# EAGLE design schematic (EAGLE 9.5.2)
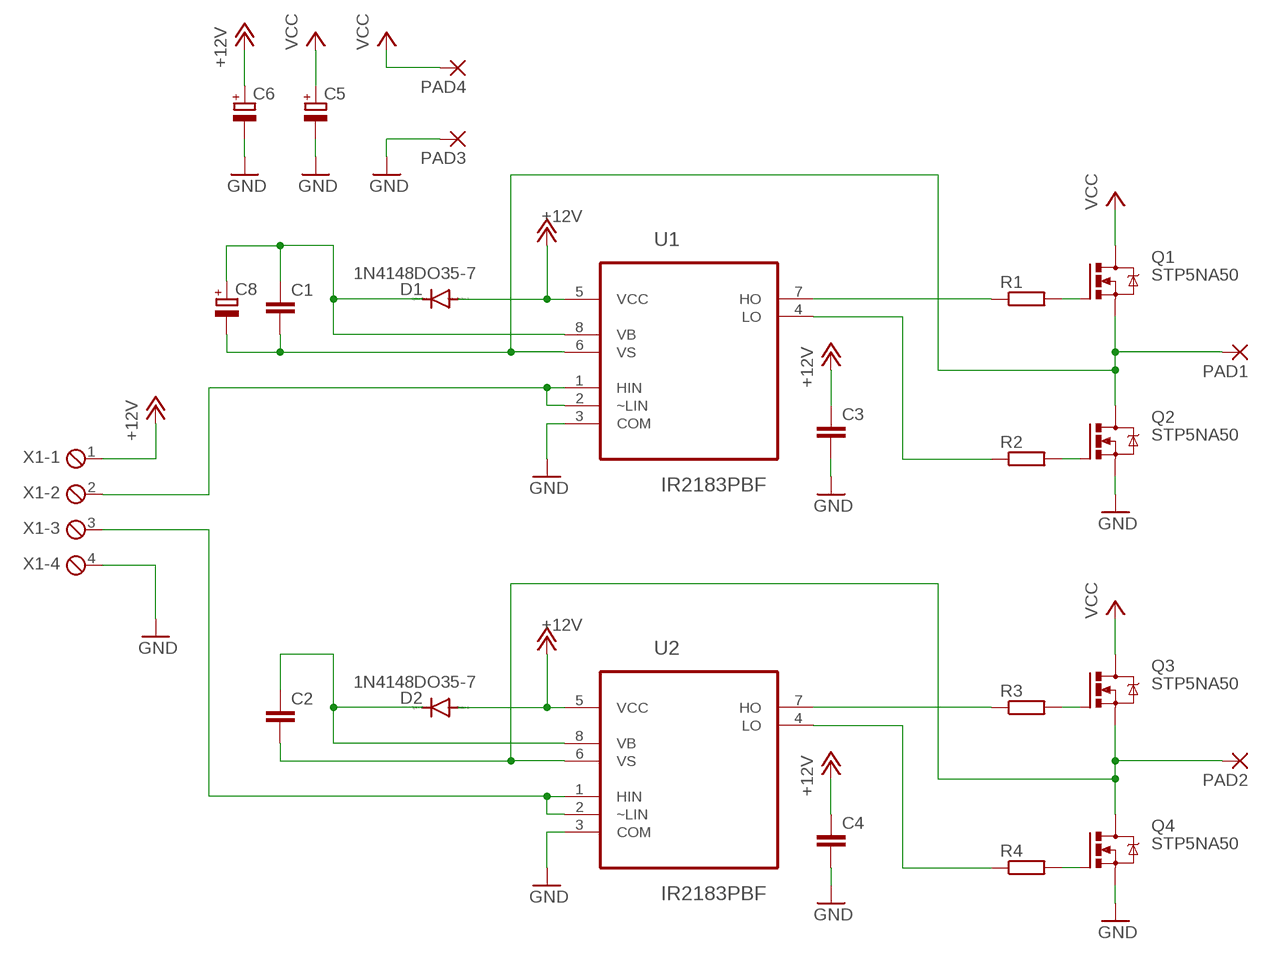
[diagram p0: schematic, sheet 1]

## Parts
C1  C-EU050-024X044  [C050-024X044]
C2  C-EU050-024X044  [C050-024X044]
C3  C-EU050-024X044  [C050-024X044]
C4  C-EU050-024X044  [C050-024X044]
C5  CPOL-EUE5-10.5  [E5-10,5]
C6  CPOL-EUE2.5-6  [E2,5-6]
C8  CPOL-EUE2.5-6  [E2,5-6]
D1  1N4148DO35-7  [DO35-7]
D2  1N4148DO35-7  [DO35-7]
PAD1  3,81/1,4  [3,81/1,4]
PAD2  3,81/1,4  [3,81/1,4]
PAD3  3,81/1,4  [3,81/1,4]
PAD4  3,81/1,4  [3,81/1,4]
Q1  STP5NA50  [TO220BV]
Q2  STP5NA50  [TO220BV]
Q3  STP5NA50  [TO220BV]
Q4  STP5NA50  [TO220BV]
R1  R-EU_0204/7  [0204/7]
R2  R-EU_0204/7  [0204/7]
R3  R-EU_0204/7  [0204/7]
R4  R-EU_0204/7  [0204/7]
U1  IR2183PBF  [DIP254P762X533-8]
U2  IR2183PBF  [DIP254P762X533-8]
X1  MPT4  [4POL254]

## Nets
+12V: C3.1 C4.1 C6.+ D1.A D2.A U1.5(VCC) U2.5(VCC) X1.1
GND: C3.2 C4.2 C5.- C6.- PAD3.1(P) Q2.S Q4.S U1.3(COM) U2.3(COM) X1.4
N$1: Q2.G R2.2
N$2: C1.2 C8.- PAD1.1(P) Q1.S Q2.D U1.6(VS)
N$3: Q1.G R1.2
N$4: R1.1 U1.7(HO)
N$5: R2.1 U1.4(LO)
N$6: C1.1 C8.+ D1.C U1.8(VB)
N$7: U1.1(HIN) U1.2(~LIN) X1.2
N$8: Q4.G R4.2
N$9: C2.2 PAD2.1(P) Q3.S Q4.D U2.6(VS)
N$10: Q3.G R3.2
N$11: R3.1 U2.7(HO)
N$12: R4.1 U2.4(LO)
N$13: C2.1 D2.C U2.8(VB)
N$14: U2.1(HIN) U2.2(~LIN) X1.3
VCC: C5.+ PAD4.1(P) Q1.D Q3.D

## Library data of the parts
C1-C4 = rcl:C-EU: CAPACITOR, European symbol; SPICEPREFIX: C
C5 C6 C8 = rcl:CPOL-EU: POLARIZED CAPACITOR, European symbol; SPICEPREFIX: C
D1 D2 = diode:1N4148: DIODE high speed (Philips)
PAD1-PAD4 = wirepad:3,81/1,4: THROUGH-HOLE PAD
Q1-Q4 = transistor-power:STP5NA50: N-CHANNEL MOS FET
R1-R4 = rcl:R-EU_: RESISTOR, European symbol; SPICEPREFIX: R
U1 U2 = IR2183PBF:IR2183PBF: HALF-BRIDGE DRIVER; AVAILABILITY: Unavailable; DESCRIPTION: Half-Bridge Gate Driver IC Inverting, Non-Inverting 8-PDIP; MF: Infineon Technologies; MP: IR2183PBF; PACKAGE: DIP-8 Infineon; PRICE: None
X1 = con-phoenix-254:MPT4: PHOENIX CONNECTOR; OC_FARNELL: unknown; OC_NEWARK: unknown

## Board
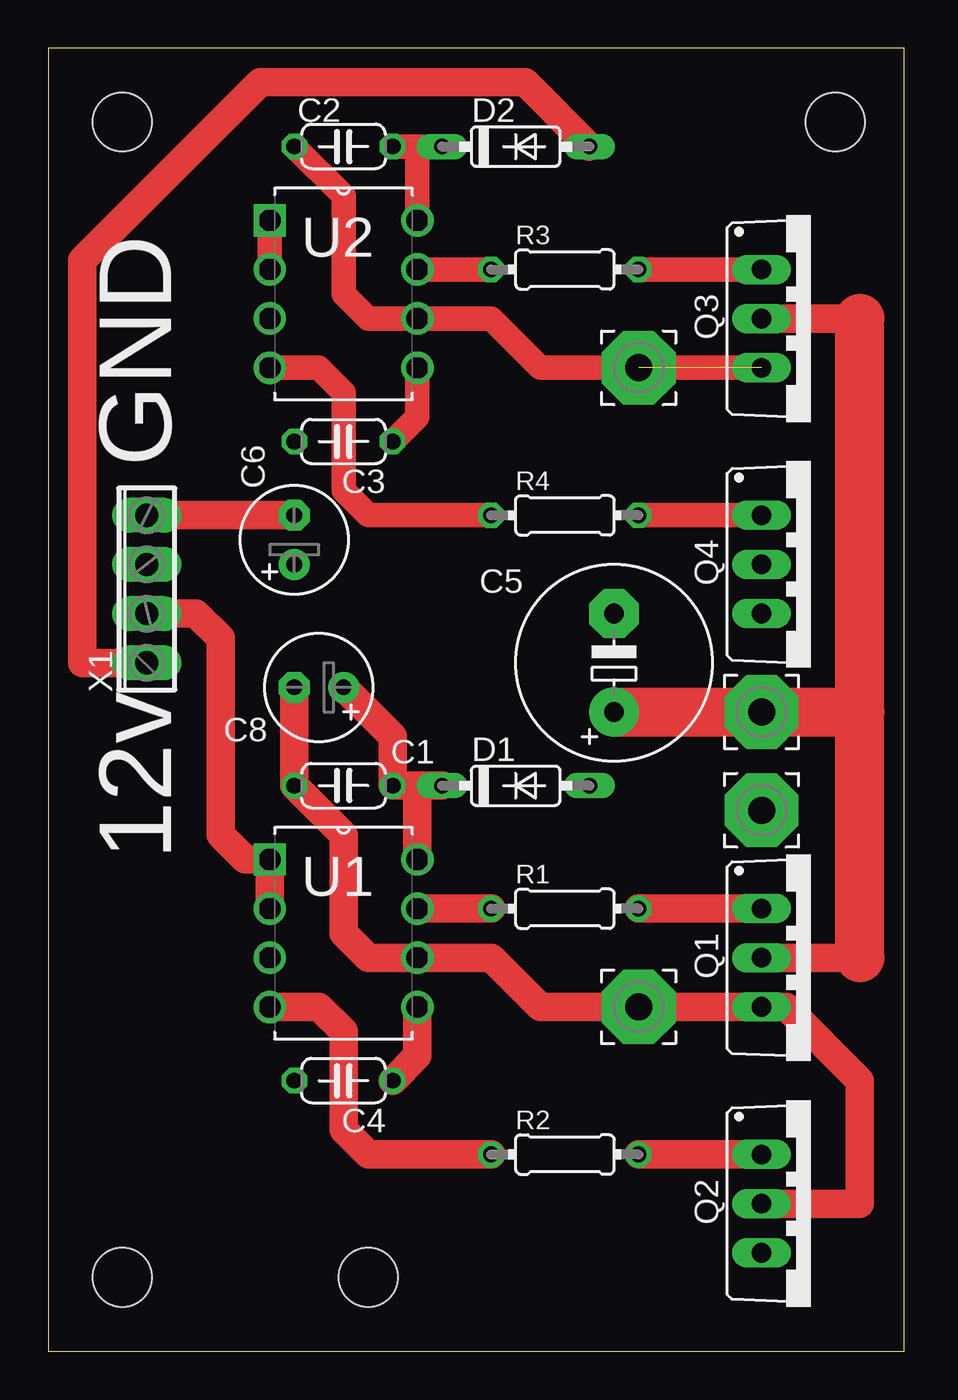
[diagram p1: board, top side]
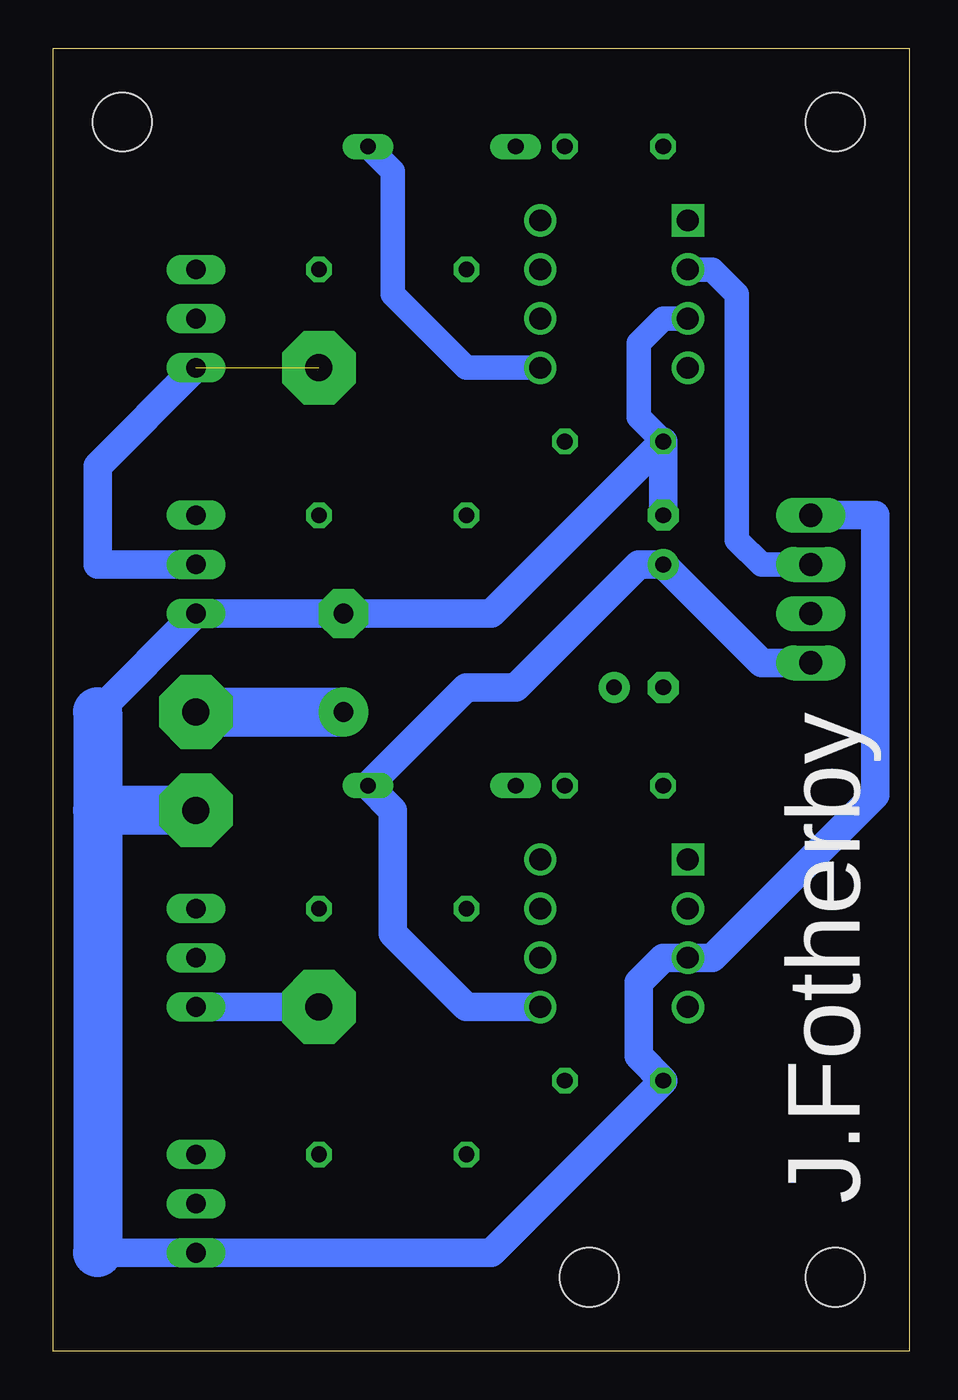
[diagram p2: board, bottom side, seen from below]

Size 44.2 x 67.3 mm. Coordinates in mm from the lower left corner, seen from the top.
Outline: 0,0 44.2,0 44.2,67.3 0,67.3 0,0
Copper layers (1*16): Top 0.035mm / dielectric 1.5mm / Bottom 0.035mm
Design rules "default": minimum track width 6mil, minimum drill 0.35mm, track to track 6mil, track to pad 6mil, pad to pad 6mil, via to via 6mil, smd to smd 6mil, copper to edge 40mil, drill to drill 6mil, minimum pad ring 10mil, minimum via ring 8mil, stop-mask expansion 4mil, vias tented up to drill 0mil, thermal gap 10mil
Holes 3.05 mm at 16.51,3.81 40.64,63.5 3.81,63.5 3.81,3.81

### Footprints (pad centres in the part's own frame; a part is rotated, then mirrored left to right if it is on the bottom)
C050-024X044 = drill 0.813 octagon: 1 -2.54,0; 2 2.54,0
E5-10,5 = drill 1.016 pad 2.54: + -2.54,0 | drill 1.016 pad 2.54 octagon: - 2.54,0
E2,5-6 = drill 0.813 pad 1.6: + -1.27,0 | drill 0.813 pad 1.6 octagon: - 1.27,0
DO35-7 = drill 0.813 long: A 3.81,0; C -3.81,0
3,81/1,4 = drill 1.397 pad 3.81 octagon: 1 0,0
TO220BV = drill 1.016 long: D 0,-2.54; G -2.54,-2.54; S 2.54,-2.54
0204/7 = drill 0.813 octagon: 1 -3.81,0; 2 3.81,0
DIP254P762X533-8 = drill 1.118 square: 1 -7.62,7.62 | drill 1.118: 2 -7.62,5.08; 3 -7.62,2.54; 4 -7.62,0; 5 0,0; 6 0,2.54; 7 0,5.08; 8 0,7.62
4POL254 = drill 1.2 long: 1 -3.81,0; 2 -1.27,0; 3 1.27,0; 4 3.81,0

### Placement (x,y rotation side)
C1  15.24,29.21 180 top
C2  15.24,62.23 180 top
C3  15.24,46.99 180 top
C4  15.24,13.97 180 top
C5  29.21,35.56 90 top
C6  12.7,41.91 90 top
C8  13.97,34.29 180 top
D1  24.13,29.21 0 top
D2  24.13,62.23 0 top
PAD1  30.48,17.78 0 top
PAD2  30.48,50.8 0 top
PAD3  36.83,27.94 270 top
PAD4  36.83,33.02 270 top
Q1  39.37,20.32 270 top
Q2  39.37,7.62 270 top
Q3  39.37,53.34 270 top
Q4  39.37,40.64 270 top
R1  26.67,22.86 0 top
R2  26.67,10.16 0 top
R3  26.67,55.88 0 top
R4  26.67,43.18 0 top
U1  19.05,17.78 0 top
U2  19.05,50.8 0 top
X1  5.08,39.37 90 top

### Tracks (layer width: path | path; a pad name or v marks a point on that pad's centre or on a via)
+12V
  Top 1.27: C3.1 19.05,48.26 U2.5
  Top 1.473: U1.5 19.05,15.24 C4.1 | D2.A 24.62,65.55 10.94,65.55 1.75,56.36 1.75,35.56 X1.1
  Bottom 1.27: D2.A 26.67,60.96 26.67,54.61 22.86,50.8 U2.5
  Bottom 1.473: U1.5 22.86,17.78 26.67,21.59 26.67,27.94 D1.A 22.86,34.29 20.32,34.29 13.97,40.64 C6.+ 7.62,35.56 X1.1
GND
  Top 1.473: X1.4 C6.-
  Bottom 1.27: U2.3 12.7,53.34 13.97,52.07 13.97,48.26 C3.2
  Bottom 1.473: C6.- C3.2 21.59,38.1 C5.- Q4.S 41.91,33.02 | 41.91,5.08 Q2.S 21.59,5.08 C4.2 13.97,15.24 13.97,19.05 12.7,20.32 U1.3 10.16,20.32 1.75,28.73 1.75,43.18 X1.4
  Bottom 2.54: 41.91,33.02 41.91,27.94 | 41.91,27.94 41.91,5.08 | PAD3.1 41.91,27.94
N$1
  Top 1.473: R2.2 Q2.G
N$2
  Top 1.473: Q2.D 41.91,7.62 41.91,13.97 38.1,17.78 Q1.S 25.4,17.78 22.86,20.32 U1.6 16.51,20.32 15.24,21.59 15.24,26.67 C1.2 C8.-
  Bottom 1.473: Q1.S PAD1.1
N$3
  Top 1.473: R1.2 Q1.G
N$4
  Top 1.473: U1.7 R1.1
N$5
  Top 1.473: U1.4 13.97,17.78 15.24,16.51 15.24,11.43 16.51,10.16 R2.1
N$6
  Top 1.473: U1.8 19.05,29.21 | 19.05,29.21 C1.1 17.78,31.75 C8.+ | D1.C 19.05,29.21
N$7
  Top 1.473: U1.2 U1.1 10.16,25.4 8.89,26.67 8.89,36.83 7.62,38.1 X1.2
N$8
  Top 1.27: R4.2 Q4.G
N$9  (1 unrouted)
  Top 1.27: Q3.S 25.4,50.8 22.86,53.34 U2.6 16.51,53.34 15.24,54.61 15.24,59.69 C2.2
  Bottom 1.473: Q4.D 41.91,40.64 41.91,45.72 Q3.S
N$10
  Top 1.27: R3.2 Q3.G
N$11
  Top 1.27: U2.7 R3.1
N$12
  Top 1.27: U2.4 13.97,50.8 15.24,49.53 15.24,44.45 16.51,43.18 R4.1
N$13
  Top 1.27: U2.8 19.05,62.23 | 19.05,62.23 C2.1 | D2.C 19.05,62.23
N$14
  Top 1.27: U2.1 U2.2
  Bottom 1.27: X1.3 7.62,40.64 8.89,41.91 8.89,54.61 10.16,55.88 U2.2
VCC
  Top 1.473: Q1.D 41.91,20.32 | 41.91,53.34 Q3.D
  Top 2.54: 41.91,20.32 41.91,33.02 | 41.91,33.02 41.91,53.34 | C5.+ 41.91,33.02
  Bottom 2.54: PAD4.1 C5.+

### Text on the board
tNames: GND | 12v
bNames: J.Fotherby